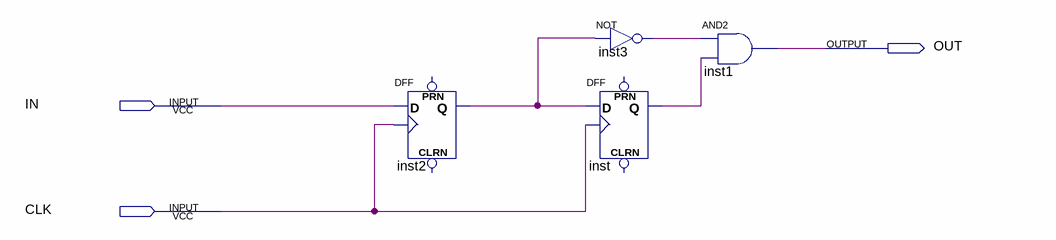
[diagram p0: schematic sheet]
// Quartus schematic F_E_D.bdf as structural Verilog: 4 symbols, 3 pins
module F_E_D (
  input  IN,
  input  CLK,
  output OUT
);

  wire inst2_q, inst3_out, inst_q;

  DFF inst2 (.CLK(CLK), .D(IN), .Q(inst2_q));  // open: CLRN, PRN
  DFF inst (.CLK(CLK), .D(inst2_q), .Q(inst_q));  // open: CLRN, PRN
  not inst3 (inst3_out, inst2_q);
  and inst1 (OUT, inst3_out, inst_q);
endmodule
